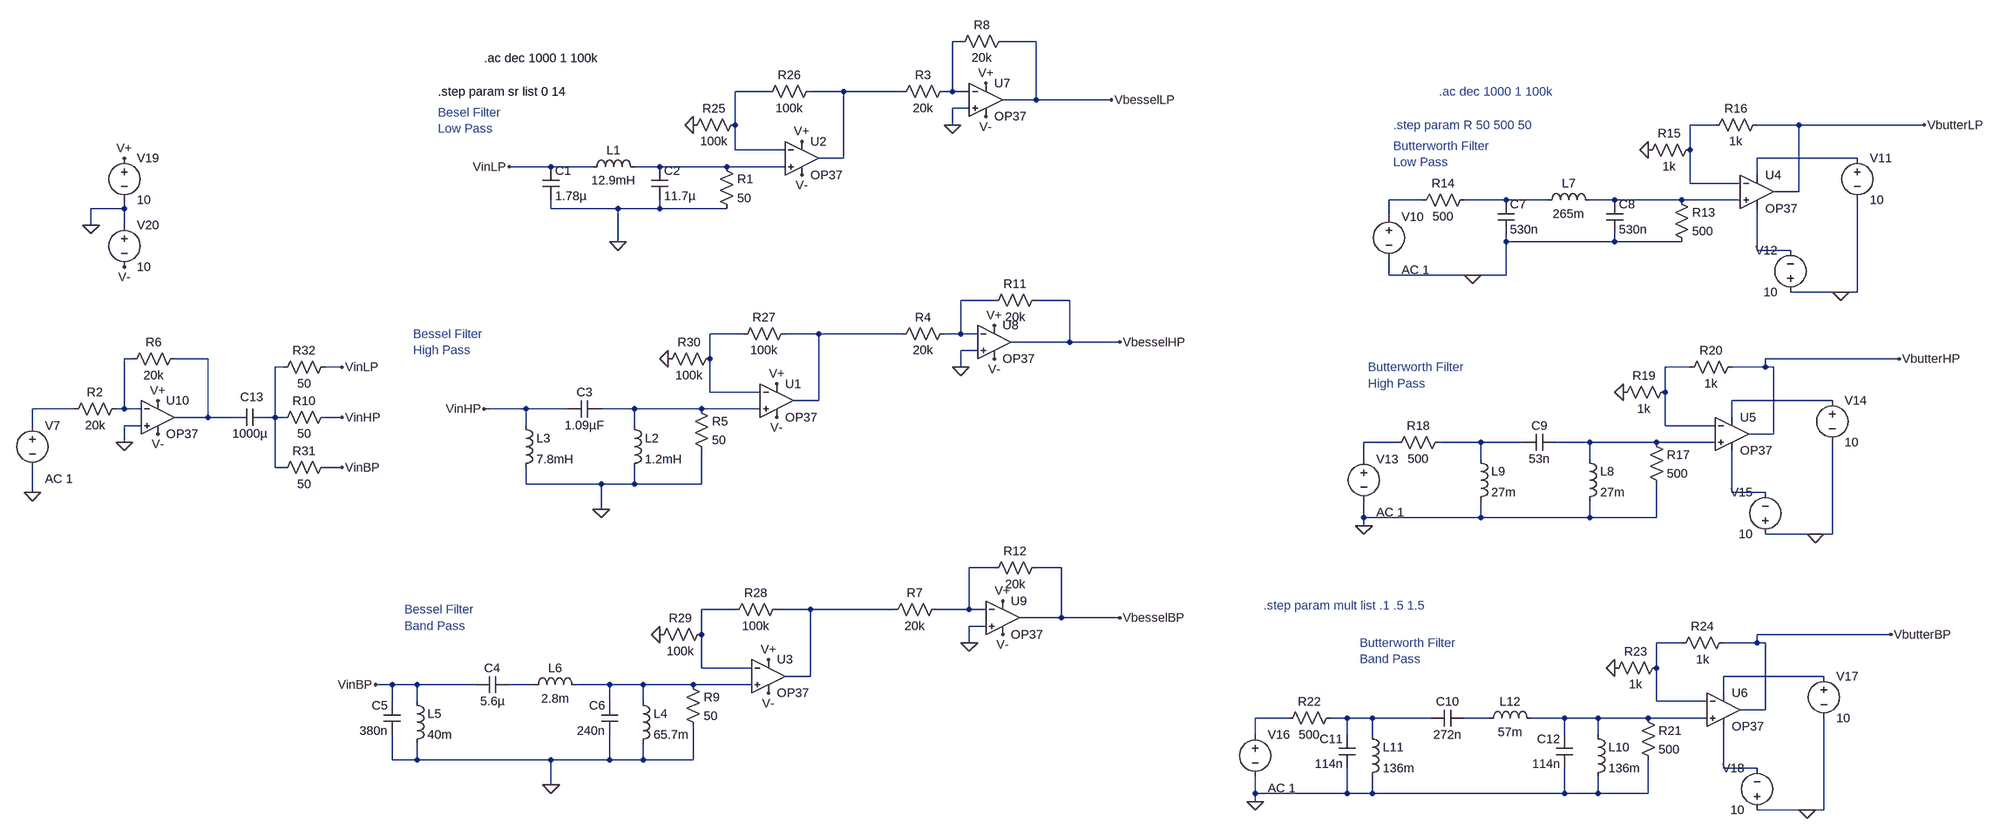
[diagram p0: schematic All Filters.asc]
All Filters.asc, the LTspice schematic file:
Version 4
SHEET 1 2780 1472
WIRE 128 -16 112 -16
WIRE 272 -16 208 -16
WIRE -240 80 -304 80
WIRE -96 80 -160 80
WIRE 16 80 -96 80
WIRE 112 80 112 -16
WIRE 112 80 96 80
WIRE 144 80 112 80
WIRE 272 96 272 -16
WIRE 272 96 208 96
WIRE 416 96 272 96
WIRE 144 112 112 112
WIRE -304 144 -304 80
WIRE 112 144 112 112
WIRE 2256 144 2208 144
WIRE 2416 144 2336 144
WIRE 2656 144 2416 144
WIRE -304 192 -304 144
WIRE -208 192 -304 192
WIRE 2208 192 2208 144
WIRE -96 208 -96 80
WIRE -96 208 -144 208
WIRE 2528 208 2336 208
WIRE -656 224 -736 224
WIRE -576 224 -656 224
WIRE -448 224 -496 224
WIRE -320 224 -448 224
WIRE -208 224 -320 224
WIRE 2336 240 2336 208
WIRE 2208 256 2208 192
WIRE 2304 256 2208 256
WIRE 2416 272 2416 144
WIRE 2416 272 2368 272
WIRE 1696 288 1632 288
WIRE 1856 288 1776 288
WIRE 1936 288 1856 288
WIRE 2064 288 2016 288
WIRE 2192 288 2064 288
WIRE 2304 288 2192 288
WIRE -1472 304 -1472 288
WIRE -1472 304 -1536 304
WIRE -656 304 -656 288
WIRE -528 304 -656 304
WIRE -448 304 -448 288
WIRE -448 304 -528 304
WIRE -320 304 -448 304
WIRE 1632 320 1632 288
WIRE -1536 336 -1536 304
WIRE -1472 336 -1472 304
WIRE -528 368 -528 304
WIRE 1856 368 1856 352
WIRE 2064 368 2064 352
WIRE 2064 368 1856 368
WIRE 2192 368 2064 368
WIRE 2336 384 2336 304
WIRE 2400 384 2336 384
WIRE 1632 432 1632 400
WIRE 1792 432 1632 432
WIRE 1856 432 1856 368
WIRE 1856 432 1792 432
WIRE 2496 464 2400 464
WIRE 2528 464 2528 288
WIRE 2528 464 2496 464
WIRE 192 480 128 480
WIRE 336 480 272 480
WIRE -288 544 -352 544
WIRE -144 544 -208 544
WIRE 16 544 -144 544
WIRE 128 544 128 480
WIRE 128 544 96 544
WIRE 160 544 128 544
WIRE 336 560 336 480
WIRE 336 560 224 560
WIRE 432 560 336 560
WIRE 160 576 128 576
WIRE -1456 592 -1472 592
WIRE -1312 592 -1376 592
WIRE -352 592 -352 544
WIRE 2608 592 2352 592
WIRE -1168 608 -1184 608
WIRE -1056 608 -1088 608
WIRE 128 608 128 576
WIRE 2208 608 2160 608
WIRE 2352 608 2352 592
WIRE 2352 608 2288 608
WIRE 2368 608 2352 608
WIRE -352 656 -352 592
WIRE -256 656 -352 656
WIRE 2160 656 2160 608
WIRE -144 672 -144 544
WIRE -144 672 -192 672
WIRE 2480 672 2288 672
WIRE -1568 688 -1648 688
WIRE -1472 688 -1472 592
WIRE -1472 688 -1488 688
WIRE -1440 688 -1472 688
WIRE -704 688 -784 688
WIRE -624 688 -704 688
WIRE -496 688 -560 688
WIRE -368 688 -496 688
WIRE -256 688 -368 688
WIRE -1312 704 -1312 592
WIRE -1312 704 -1376 704
WIRE -1264 704 -1312 704
WIRE -1184 704 -1184 608
WIRE -1184 704 -1200 704
WIRE -1168 704 -1184 704
WIRE -1056 704 -1088 704
WIRE 2288 704 2288 672
WIRE -1648 720 -1648 688
WIRE -1440 720 -1472 720
WIRE -704 720 -704 688
WIRE -496 720 -496 688
WIRE 2160 720 2160 656
WIRE 2256 720 2160 720
WIRE 2368 736 2368 608
WIRE 2368 736 2320 736
WIRE -1472 752 -1472 720
WIRE 1648 752 1584 752
WIRE 1808 752 1728 752
WIRE 1888 752 1808 752
WIRE 2016 752 1952 752
WIRE 2144 752 2016 752
WIRE 2256 752 2144 752
WIRE 1584 784 1584 752
WIRE 1808 784 1808 752
WIRE 2016 784 2016 752
WIRE -1184 800 -1184 704
WIRE -1168 800 -1184 800
WIRE -1056 800 -1088 800
WIRE -704 832 -704 800
WIRE -560 832 -704 832
WIRE -496 832 -496 800
WIRE -496 832 -560 832
WIRE -368 832 -368 768
WIRE -368 832 -496 832
WIRE -1648 848 -1648 800
WIRE 2288 848 2288 768
WIRE 2352 848 2288 848
WIRE -560 880 -560 832
WIRE 1584 896 1584 864
WIRE 1808 896 1808 864
WIRE 1808 896 1584 896
WIRE 2016 896 2016 864
WIRE 2016 896 1808 896
WIRE 2144 896 2144 832
WIRE 2144 896 2016 896
WIRE 1584 912 1584 896
WIRE 2448 928 2352 928
WIRE 2480 928 2480 752
WIRE 2480 928 2448 928
WIRE 192 992 144 992
WIRE 320 992 272 992
WIRE -304 1072 -368 1072
WIRE -160 1072 -224 1072
WIRE 0 1072 -160 1072
WIRE 144 1072 144 992
WIRE 144 1072 80 1072
WIRE 176 1072 144 1072
WIRE 320 1088 320 992
WIRE 320 1088 240 1088
WIRE 432 1088 320 1088
WIRE 176 1104 144 1104
WIRE -368 1120 -368 1072
WIRE 2592 1120 2336 1120
WIRE 144 1136 144 1104
WIRE 2192 1136 2144 1136
WIRE 2336 1136 2336 1120
WIRE 2336 1136 2272 1136
WIRE 2352 1136 2336 1136
WIRE -368 1184 -368 1120
WIRE -272 1184 -368 1184
WIRE 2144 1184 2144 1136
WIRE -160 1200 -160 1072
WIRE -160 1200 -208 1200
WIRE 2464 1200 2272 1200
WIRE -960 1216 -992 1216
WIRE -912 1216 -960 1216
WIRE -800 1216 -912 1216
WIRE -688 1216 -736 1216
WIRE -544 1216 -608 1216
WIRE -480 1216 -544 1216
WIRE -384 1216 -480 1216
WIRE -272 1216 -384 1216
WIRE 2272 1232 2272 1200
WIRE -960 1248 -960 1216
WIRE -912 1248 -912 1216
WIRE -544 1248 -544 1216
WIRE -480 1248 -480 1216
WIRE 2144 1248 2144 1184
WIRE 2240 1248 2144 1248
WIRE 2352 1264 2352 1136
WIRE 2352 1264 2304 1264
WIRE 1440 1280 1376 1280
WIRE 1552 1280 1520 1280
WIRE 1600 1280 1552 1280
WIRE 1712 1280 1600 1280
WIRE 1824 1280 1776 1280
WIRE 1968 1280 1904 1280
WIRE 2032 1280 1968 1280
WIRE 2128 1280 2032 1280
WIRE 2240 1280 2128 1280
WIRE 1376 1312 1376 1280
WIRE 1552 1312 1552 1280
WIRE 1600 1312 1600 1280
WIRE 1968 1312 1968 1280
WIRE 2032 1312 2032 1280
WIRE -960 1360 -960 1312
WIRE -912 1360 -912 1328
WIRE -912 1360 -960 1360
WIRE -656 1360 -912 1360
WIRE -544 1360 -544 1312
WIRE -544 1360 -656 1360
WIRE -480 1360 -480 1328
WIRE -480 1360 -544 1360
WIRE -384 1360 -384 1296
WIRE -384 1360 -480 1360
WIRE 2272 1376 2272 1296
WIRE 2336 1376 2272 1376
WIRE -656 1408 -656 1360
WIRE 1376 1424 1376 1392
WIRE 1552 1424 1552 1376
WIRE 1552 1424 1376 1424
WIRE 1600 1424 1600 1392
WIRE 1600 1424 1552 1424
WIRE 1968 1424 1968 1376
WIRE 1968 1424 1600 1424
WIRE 2032 1424 2032 1392
WIRE 2032 1424 1968 1424
WIRE 2128 1424 2128 1360
WIRE 2128 1424 2032 1424
WIRE 1376 1440 1376 1424
WIRE 2432 1456 2336 1456
WIRE 2464 1456 2464 1280
WIRE 2464 1456 2432 1456
FLAG 432 560 VbesselHP
FLAG 432 1088 VbesselBP
FLAG 416 96 VbesselLP
FLAG 1792 432 0
FLAG 2128 192 0
FLAG 2496 464 0
FLAG 1584 912 0
FLAG 2080 656 0
FLAG 2448 928 0
FLAG 2608 592 VbutterHP
FLAG 1376 1440 0
FLAG 2064 1184 0
FLAG 2432 1456 0
FLAG 2592 1120 VbutterBP
FLAG 2656 144 VbutterLP
FLAG -1472 208 V+
FLAG -1472 416 V-
FLAG -1536 336 0
FLAG -176 176 V+
FLAG -224 640 V+
FLAG -240 1168 V+
FLAG -176 240 V-
FLAG -224 704 V-
FLAG -240 1232 V-
FLAG 176 64 V+
FLAG 192 528 V+
FLAG 208 1056 V+
FLAG 176 128 V-
FLAG 192 592 V-
FLAG 208 1120 V-
FLAG -432 592 0
FLAG -448 1120 0
FLAG 112 144 0
FLAG 128 608 0
FLAG 144 1136 0
FLAG -384 144 0
FLAG -1056 704 VinHP
FLAG -1408 672 V+
FLAG -1408 736 V-
FLAG -1472 752 0
FLAG -736 224 VinLP
FLAG -784 688 VinHP
FLAG -992 1216 VinBP
FLAG -528 368 0
FLAG -560 880 0
FLAG -656 1408 0
FLAG -1648 848 0
FLAG -1056 800 VinBP
FLAG -1056 608 VinLP
SYMBOL cap -672 224 R0
SYMATTR InstName C1
SYMATTR Value 1.78µ
SYMBOL cap -464 224 R0
SYMATTR InstName C2
SYMATTR Value 11.7µ
SYMBOL ind -592 240 R270
WINDOW 0 32 56 VTop 2
WINDOW 3 5 56 VBottom 2
SYMATTR InstName L1
SYMATTR Value 12.9mH
SYMATTR SpiceLine Rser={sr}
SYMBOL res -336 208 R0
SYMATTR InstName R1
SYMATTR Value 50
SYMBOL Opamps/OP37 -176 144 R0
SYMATTR InstName U2
SYMBOL cap -560 672 R90
WINDOW 0 0 32 VBottom 2
WINDOW 3 32 32 VTop 2
SYMATTR InstName C3
SYMATTR Value 1.09µF
SYMBOL ind -512 704 R0
SYMATTR InstName L2
SYMATTR Value 1.2mH
SYMBOL res -384 672 R0
SYMATTR InstName R5
SYMATTR Value 50
SYMBOL Opamps/OP37 -224 608 R0
SYMATTR InstName U1
SYMBOL ind -720 704 R0
SYMATTR InstName L3
SYMATTR Value 7.8mH
SYMBOL cap -736 1200 R90
WINDOW 0 0 32 VBottom 2
WINDOW 3 32 32 VTop 2
SYMATTR InstName C4
SYMATTR Value 5.6µ
SYMBOL ind -496 1232 R0
SYMATTR InstName L4
SYMATTR Value 65.7m
SYMATTR SpiceLine Rser=130
SYMBOL res -400 1200 R0
SYMATTR InstName R9
SYMATTR Value 50
SYMBOL voltage -1648 704 R0
WINDOW 123 24 118 Left 2
SYMATTR Value2 AC 1
SYMATTR InstName V7
SYMATTR Value ""
SYMBOL Opamps/OP37 -240 1136 R0
SYMATTR InstName U3
SYMBOL ind -928 1232 R0
SYMATTR InstName L5
SYMATTR Value 40m
SYMBOL cap -944 1312 R180
WINDOW 0 24 56 Left 2
WINDOW 3 24 8 Left 2
SYMATTR InstName C5
SYMATTR Value 380n
SYMBOL cap -528 1312 R180
WINDOW 0 24 56 Left 2
WINDOW 3 24 8 Left 2
SYMATTR InstName C6
SYMATTR Value 240n
SYMBOL ind -704 1232 R270
WINDOW 0 32 56 VTop 2
WINDOW 3 5 56 VBottom 2
SYMATTR InstName L6
SYMATTR Value 2.8m
SYMBOL cap 1840 288 R0
SYMATTR InstName C7
SYMATTR Value 530n
SYMBOL cap 2048 288 R0
SYMATTR InstName C8
SYMATTR Value 530n
SYMBOL ind 1920 304 R270
WINDOW 0 32 56 VTop 2
WINDOW 3 5 56 VBottom 2
SYMATTR InstName L7
SYMATTR Value 265m
SYMBOL res 2176 272 R0
SYMATTR InstName R13
SYMATTR Value 500
SYMBOL res 1680 304 R270
WINDOW 0 32 56 VTop 2
WINDOW 3 0 56 VBottom 2
SYMATTR InstName R14
SYMATTR Value 500
SYMBOL voltage 1632 304 R0
WINDOW 123 24 118 Left 2
SYMATTR Value2 AC 1
SYMATTR InstName V10
SYMATTR Value ""
SYMBOL res 2112 208 R270
WINDOW 0 32 56 VTop 2
WINDOW 3 0 56 VBottom 2
SYMATTR InstName R15
SYMATTR Value 1k
SYMBOL res 2240 160 R270
WINDOW 0 32 56 VTop 2
WINDOW 3 0 56 VBottom 2
SYMATTR InstName R16
SYMATTR Value 1k
SYMBOL Opamps/OP37 2336 208 R0
SYMATTR InstName U4
SYMBOL voltage 2528 192 R0
SYMATTR InstName V11
SYMATTR Value 10
SYMBOL voltage 2400 480 R180
WINDOW 0 24 96 Left 2
WINDOW 3 24 16 Left 2
SYMATTR InstName V12
SYMATTR Value 10
SYMBOL cap 1952 736 R90
WINDOW 0 0 32 VBottom 2
WINDOW 3 32 32 VTop 2
SYMATTR InstName C9
SYMATTR Value 53n
SYMBOL ind 2000 768 R0
SYMATTR InstName L8
SYMATTR Value 27m
SYMBOL res 2128 736 R0
SYMATTR InstName R17
SYMATTR Value 500
SYMBOL res 1632 768 R270
WINDOW 0 32 56 VTop 2
WINDOW 3 0 56 VBottom 2
SYMATTR InstName R18
SYMATTR Value 500
SYMBOL voltage 1584 768 R0
WINDOW 123 24 118 Left 2
SYMATTR Value2 AC 1
SYMATTR InstName V13
SYMATTR Value ""
SYMBOL res 2064 672 R270
WINDOW 0 32 56 VTop 2
WINDOW 3 0 56 VBottom 2
SYMATTR InstName R19
SYMATTR Value 1k
SYMBOL res 2192 624 R270
WINDOW 0 32 56 VTop 2
WINDOW 3 0 56 VBottom 2
SYMATTR InstName R20
SYMATTR Value 1k
SYMBOL Opamps/OP37 2288 672 R0
SYMATTR InstName U5
SYMBOL voltage 2480 656 R0
SYMATTR InstName V14
SYMATTR Value 10
SYMBOL voltage 2352 944 R180
WINDOW 0 24 96 Left 2
WINDOW 3 24 16 Left 2
SYMATTR InstName V15
SYMATTR Value 10
SYMBOL ind 1792 768 R0
SYMATTR InstName L9
SYMATTR Value 27m
SYMBOL cap 1776 1264 R90
WINDOW 0 0 32 VBottom 2
WINDOW 3 32 32 VTop 2
SYMATTR InstName C10
SYMATTR Value 272n
SYMBOL ind 2016 1296 R0
SYMATTR InstName L10
SYMATTR Value 136m
SYMBOL res 2112 1264 R0
SYMATTR InstName R21
SYMATTR Value 500
SYMBOL res 1424 1296 R270
WINDOW 0 32 56 VTop 2
WINDOW 3 0 56 VBottom 2
SYMATTR InstName R22
SYMATTR Value 500
SYMBOL voltage 1376 1296 R0
WINDOW 123 24 118 Left 2
SYMATTR Value2 AC 1
SYMATTR InstName V16
SYMATTR Value ""
SYMBOL res 2048 1200 R270
WINDOW 0 32 56 VTop 2
WINDOW 3 0 56 VBottom 2
SYMATTR InstName R23
SYMATTR Value 1k
SYMBOL res 2176 1152 R270
WINDOW 0 32 56 VTop 2
WINDOW 3 0 56 VBottom 2
SYMATTR InstName R24
SYMATTR Value 1k
SYMBOL Opamps/OP37 2272 1200 R0
SYMATTR InstName U6
SYMBOL voltage 2464 1184 R0
SYMATTR InstName V17
SYMATTR Value 10
SYMBOL voltage 2336 1472 R180
WINDOW 0 24 96 Left 2
WINDOW 3 24 16 Left 2
SYMATTR InstName V18
SYMATTR Value 10
SYMBOL ind 1584 1296 R0
SYMATTR InstName L11
SYMATTR Value 136m
SYMBOL cap 1568 1376 R180
WINDOW 0 24 56 Left 2
WINDOW 3 24 8 Left 2
SYMATTR InstName C11
SYMATTR Value 114n
SYMBOL cap 1984 1376 R180
WINDOW 0 24 56 Left 2
WINDOW 3 24 8 Left 2
SYMATTR InstName C12
SYMATTR Value 114n
SYMBOL ind 1808 1296 R270
WINDOW 0 32 56 VTop 2
WINDOW 3 5 56 VBottom 2
SYMATTR InstName L12
SYMATTR Value 57m
SYMBOL Opamps/OP37 176 32 R0
SYMATTR InstName U7
SYMBOL Opamps/OP37 192 496 R0
SYMATTR InstName U8
SYMBOL voltage -1472 192 R0
SYMATTR InstName V19
SYMATTR Value 10
SYMBOL voltage -1472 320 R0
SYMATTR InstName V20
SYMATTR Value 10
SYMBOL Opamps/OP37 208 1024 R0
SYMATTR InstName U9
SYMBOL res 112 64 R90
WINDOW 0 0 56 VBottom 2
WINDOW 3 32 56 VTop 2
SYMATTR InstName R3
SYMATTR Value 20k
SYMBOL res 112 528 R90
WINDOW 0 0 56 VBottom 2
WINDOW 3 32 56 VTop 2
SYMATTR InstName R4
SYMATTR Value 20k
SYMBOL res 96 1056 R90
WINDOW 0 0 56 VBottom 2
WINDOW 3 32 56 VTop 2
SYMATTR InstName R7
SYMATTR Value 20k
SYMBOL res 224 -32 R90
WINDOW 0 0 56 VBottom 2
WINDOW 3 32 56 VTop 2
SYMATTR InstName R8
SYMATTR Value 20k
SYMBOL res 288 464 R90
WINDOW 0 0 56 VBottom 2
WINDOW 3 32 56 VTop 2
SYMATTR InstName R11
SYMATTR Value 20k
SYMBOL res 288 976 R90
WINDOW 0 0 56 VBottom 2
WINDOW 3 32 56 VTop 2
SYMATTR InstName R12
SYMATTR Value 20k
SYMBOL res -288 128 R90
WINDOW 0 0 56 VBottom 2
WINDOW 3 32 56 VTop 2
SYMATTR InstName R25
SYMATTR Value 100k
SYMBOL res -144 64 R90
WINDOW 0 0 56 VBottom 2
WINDOW 3 32 56 VTop 2
SYMATTR InstName R26
SYMATTR Value 100k
SYMBOL res -192 528 R90
WINDOW 0 0 56 VBottom 2
WINDOW 3 32 56 VTop 2
SYMATTR InstName R27
SYMATTR Value 100k
SYMBOL res -208 1056 R90
WINDOW 0 0 56 VBottom 2
WINDOW 3 32 56 VTop 2
SYMATTR InstName R28
SYMATTR Value 100k
SYMBOL res -352 1104 R90
WINDOW 0 0 56 VBottom 2
WINDOW 3 32 56 VTop 2
SYMATTR InstName R29
SYMATTR Value 100k
SYMBOL res -336 576 R90
WINDOW 0 0 56 VBottom 2
WINDOW 3 32 56 VTop 2
SYMATTR InstName R30
SYMATTR Value 100k
SYMBOL Opamps/OP37 -1408 640 R0
SYMATTR InstName U10
SYMBOL res -1472 672 R90
WINDOW 0 0 56 VBottom 2
WINDOW 3 32 56 VTop 2
SYMATTR InstName R2
SYMATTR Value 20k
SYMBOL res -1360 576 R90
WINDOW 0 0 56 VBottom 2
WINDOW 3 32 56 VTop 2
SYMATTR InstName R6
SYMATTR Value 20k
SYMBOL res -1072 688 R90
WINDOW 0 0 56 VBottom 2
WINDOW 3 32 56 VTop 2
SYMATTR InstName R10
SYMATTR Value 50
SYMBOL cap -1200 688 R90
WINDOW 0 -7 28 VBottom 2
WINDOW 3 32 32 VTop 2
SYMATTR InstName C13
SYMATTR Value 1000µ
SYMBOL res -1072 784 R90
WINDOW 0 0 56 VBottom 2
WINDOW 3 32 56 VTop 2
SYMATTR InstName R31
SYMATTR Value 50
SYMBOL res -1072 592 R90
WINDOW 0 0 56 VBottom 2
WINDOW 3 32 56 VTop 2
SYMATTR InstName R32
SYMATTR Value 50
TEXT -784 16 Left 2 !.ac dec 1000 1 100k
TEXT -872 80 Left 2 !.step param sr list 0 14
TEXT -920 544 Left 2 ;Bessel Filter\nHigh Pass
TEXT -872 120 Left 2 ;Besel Filter\nLow Pass
TEXT -936 1072 Left 2 ;Bessel Filter\nBand Pass
TEXT 1728 80 Left 2 ;.ac dec 1000 1 100k
TEXT 1640 144 Left 2 ;.step param R 50 500 50
TEXT 1592 608 Left 2 ;Butterworth Filter\nHigh Pass
TEXT 1640 184 Left 2 ;Butterworth Filter\nLow Pass
TEXT 1576 1136 Left 2 ;Butterworth Filter\nBand Pass
TEXT 1392 1064 Left 2 ;.step param mult list .1 .5 1.5

The netlist it stands for:
* All Filters.asc
C1 VinLP 0 1.78µ
C2 N006 0 11.7µ
L1 VinLP N006 12.9mH Rser={sr}
R1 N006 0 50
XU2 N006 N002 V+ V- N003 LT1037  ; OP37, pins In+ In- V+ V- OUT
C3 N020 VinHP 1.09µF
L2 N020 0 1.2mH
R5 N020 0 50
XU1 N020 N012 V+ V- N013 LT1037  ; OP37, pins In+ In- V+ V- OUT
L3 VinHP 0 7.8mH
C4 N030 VinBP 5.6µ
L4 N031 0 65.7m Rser=130
R9 N031 0 50
V7 N019 0 AC 1
XU3 N031 N026 V+ V- N027 LT1037  ; OP37, pins In+ In- V+ V- OUT
L5 VinBP 0 40m
C5 0 VinBP 380n
C6 0 N031 240n
L6 N030 N031 2.8m
C7 N008 0 530n
C8 N009 0 530n
L7 N008 N009 265m
R13 N009 0 500
R14 N007 N008 500
V10 N007 0 AC 1
R15 0 N004 1k
R16 N004 VbutterLP 1k
XU4 N009 N004 N005 N010 VbutterLP LT1037  ; OP37, pins In+ In- V+ V- OUT
V11 N005 0 10
V12 0 N010 10
C9 N023 N022 53n
L8 N023 0 27m
R17 N023 0 500
R18 N021 N022 500
V13 N021 0 AC 1
R19 0 N017 1k
R20 N017 VbutterHP 1k
XU5 N023 N017 N018 N024 VbutterHP LT1037  ; OP37, pins In+ In- V+ V- OUT
V14 N018 0 10
V15 0 N024 10
L9 N022 0 27m
C10 N034 N033 272n
L10 N035 0 136m
R21 N035 0 500
R22 N032 N033 500
V16 N032 0 AC 1
R23 0 N028 1k
R24 N028 VbutterBP 1k
XU6 N035 N028 N029 N036 VbutterBP LT1037  ; OP37, pins In+ In- V+ V- OUT
V17 N029 0 10
V18 0 N036 10
L11 N033 0 136m
C11 0 N033 114n
C12 0 N035 114n
L12 N034 N035 57m
XU7 0 N001 V+ V- VbesselLP LT1037  ; OP37, pins In+ In- V+ V- OUT
XU8 0 N011 V+ V- VbesselHP LT1037  ; OP37, pins In+ In- V+ V- OUT
V19 V+ 0 10
V20 0 V- 10
XU9 0 N025 V+ V- VbesselBP LT1037  ; OP37, pins In+ In- V+ V- OUT
R3 N001 N003 20k
R4 N011 N013 20k
R7 N025 N027 20k
R8 VbesselLP N001 20k
R11 VbesselHP N011 20k
R12 VbesselBP N025 20k
R25 N002 0 100k
R26 N003 N002 100k
R27 N013 N012 100k
R28 N027 N026 100k
R29 N026 0 100k
R30 N012 0 100k
XU10 0 N014 V+ V- N015 LT1037  ; OP37, pins In+ In- V+ V- OUT
R2 N014 N019 20k
R6 N015 N014 20k
R10 VinHP N016 50
C13 N016 N015 1000µ
R31 VinBP N016 50
R32 VinLP N016 50
.ac dec 1000 1 100k
.step param sr list 0 14
* Bessel Filter
* High Pass
* Besel Filter
* Low Pass
* Bessel Filter
* Band Pass
* .ac dec 1000 1 100k
* .step param R 50 500 50
* Butterworth Filter
* High Pass
* Butterworth Filter
* Low Pass
* Butterworth Filter
* Band Pass
* .step param mult list .1 .5 1.5
.lib LTC.lib
.backanno
.end